# Altium project FSAE_BSPD_Simple.PrjPcb
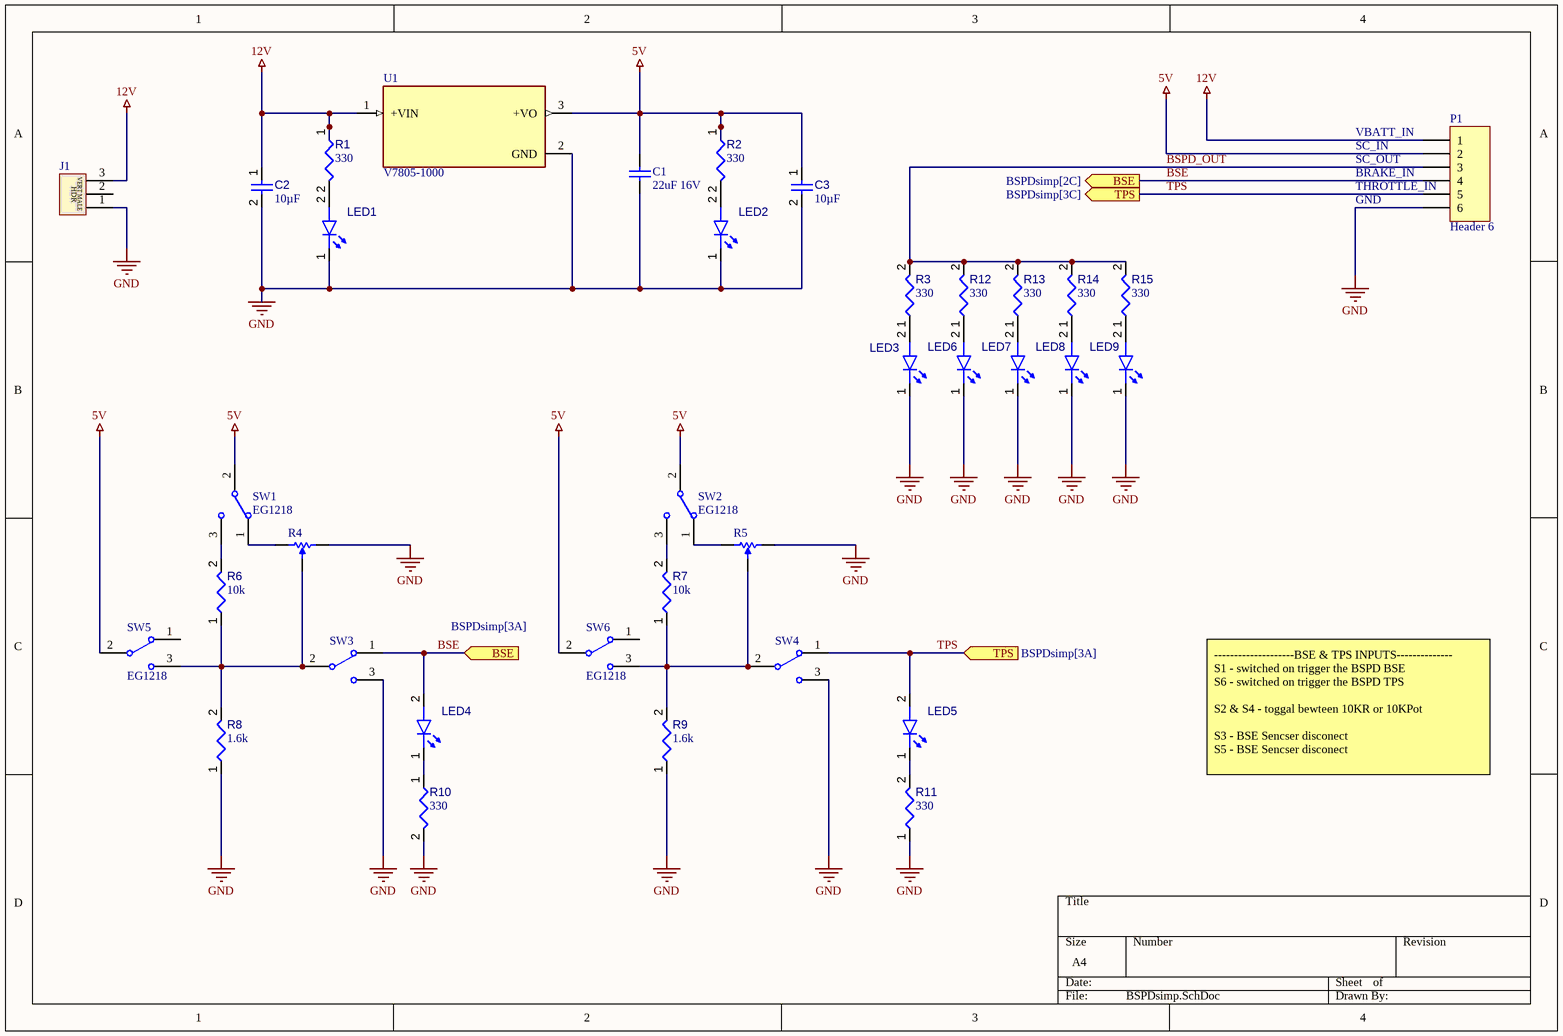
[diagram p0: BSPDsimp.SchDoc]
1 sheet, 36 parts. Net scope: flat (ports and power ports of the same name join across sheets).
Board file: FSAE_BSPD_Simple.PcbDoc

## Sheet BSPDsimp.SchDoc
size A4; SheetNumber: 1; SheetTotal: 1

### Parts
C1  22uF 16V  [CAPC2012X14N]
C2  value 10µF  [CAPC2013X135X45NL10T25]  (hidden comment: Capacitor 10 uF +/- 10% 16 V 0805)
C3  value 10µF  [CAPC2013X135X45NL10T25]  (hidden comment: Capacitor 10 uF +/- 10% 16 V 0805)
J1  HDR-3X1-VERT-2.54MM-1SIDE_SHROUD_1  [HDR-1X3-2.54MM-1SIDE_SHROUD]  (value not drawn)
LED1  QBLP595-IG  [QTB-QBLP595_V]  (value not drawn)
LED2  QBLP595-IG  [QTB-QBLP595_V]  (value not drawn)
LED3  QBLP595-IG  [QTB-QBLP595_V]  (value not drawn)
LED4  QBLP595-IG  [QTB-QBLP595_V]  (value not drawn)
LED5  QBLP595-IG  [QTB-QBLP595_V]  (value not drawn)
LED6  QBLP595-IG  [QTB-QBLP595_V]  (value not drawn)
LED7  QBLP595-IG  [QTB-QBLP595_V]  (value not drawn)
LED8  QBLP595-IG  [QTB-QBLP595_V]  (value not drawn)
LED9  QBLP595-IG  [QTB-QBLP595_V]  (value not drawn)
P1  Header 6  [HDR1X6]
R1  value 330  [RESC0402(1005)_L]  (hidden comment: 330R2J)
R2  value 330  [RESC0402(1005)_L]  (hidden comment: 330R2J)
R3  value 330  [RESC0402(1005)_L]  (hidden comment: 330R2J)
R4  35WR10KLFTR  [BI-35WR10KLFTR-3_V]  (value not drawn)
R5  35WR10KLFTR  [BI-35WR10KLFTR-3_V]  (value not drawn)
R6  value 10k  [RESC0402(1005)_L]  (hidden comment: 10KR2F)
R7  value 10k  [RESC0402(1005)_L]  (hidden comment: 10KR2F)
R8  value 1.6k  [RESC0402(1005)_L]  (hidden comment: 1D6KR2J)
R9  value 1.6k  [RESC0402(1005)_L]  (hidden comment: 1D6KR2J)
R10  value 330  [RESC0402(1005)_L]  (hidden comment: 330R2J)
R11  value 330  [RESC0402(1005)_L]  (hidden comment: 330R2J)
R12  value 330  [RESC0402(1005)_L]  (hidden comment: 330R2J)
R13  value 330  [RESC0402(1005)_L]  (hidden comment: 330R2J)
R14  value 330  [RESC0402(1005)_L]  (hidden comment: 330R2J)
R15  value 330  [RESC0402(1005)_L]  (hidden comment: 330R2J)
SW1  EG1218  [ESWI-EG1218_V]
SW2  EG1218  [ESWI-EG1218_V]
SW3  EG1218  [ESWI-EG1218_V]  (value not drawn)
SW4  EG1218  [ESWI-EG1218_V]  (value not drawn)
SW5  EG1218  [ESWI-EG1218_V]
SW6  EG1218  [ESWI-EG1218_V]
U1  V7805-1000  [CONV_V7805-1000]

### Ports
BSE (in, see BSPDsimp[3A]), BSE (out, see BSPDsimp[2C]), TPS (in, see BSPDsimp[3A]), TPS (out, see BSPDsimp[3C])

### Nets
5V: C1.2 C3.1 P1.2 R2.1 SW1.2(COM) SW2.2(COM) SW5.2(COM) SW6.2(COM) U1.3(+VO)
12V: C2.1 J1.3 P1.1 R1.1 U1.1(+VIN)
GND: C1.1 C2.2 C3.2 J1.1 LED1.1(K) LED2.1(K) LED3.1(K) LED6.1(K) LED7.1(K) LED8.1(K) LED9.1(K) P1.6 R4.3 R5.3 R8.1 R9.1 R10.2 R11.1 SW3.3 SW4.3 U1.2(GND)
BSE: LED4.2(A) P1.4 SW3.1 ; port BSE
BSPD_OUT: P1.3 R3.2 R12.2 R13.2 R14.2 R15.2
TPS: LED5.2(A) P1.5 SW4.1 ; port TPS
NetLED1_2: LED1.2(A) R1.2
NetLED2_2: LED2.2(A) R2.2
NetLED3_2: LED3.2(A) R15.1
NetLED4_1: LED4.1(K) R10.1
NetLED5_1: LED5.1(K) R11.2
NetLED6_2: LED6.2(A) R3.1
NetLED7_2: LED7.2(A) R12.1
NetLED8_2: LED8.2(A) R13.1
NetLED9_2: LED9.2(A) R14.1
NetR4_1: R4.1 SW1.1
NetR4_2: R4.2 R6.1 R8.2 SW3.2(COM) SW5.3
NetR5_1: R5.1 SW2.1
NetR5_2: R5.2 R7.1 R9.2 SW4.2(COM) SW6.3
NetR6_2: R6.2 SW1.3
NetR7_2: R7.2 SW2.3

Not connected (* = marked no-connect by the designer): J1 2; SW5 1; SW6 1

### Notes on the sheet
- (near P1) VBATT_IN
- SC_IN
- SC_OUT
- (near P1) BRAKE_IN
- (near P1) THROTTLE_IN
- GND
- --------------------BSE & TPS INPUTS--------------
  S1 - switched on trigger the BSPD BSE
  S6 - switched on trigger the BSPD TPS
  S2 & S4 - toggal bewteen 10KR or 10KPot
  S3 - BSE Sencser disconect
  S5 - BSE Sencser disconect
- (in symbol CMP-012-000045-1) VERT MALE; HDR

### Library data of the parts
C1 = C-0805-CER-22UF-X5R-16V: CAP CER 22UF 16V X5R 0805; Voltage Max: 35V; Supplier 1: Digi-Key; Supplier Part Number 1: 1276-6780-1-ND; Mounting Technology: Surface Mount; Temperature Max: 85; Temperature Min: -55
C2 C3 = CMP-001-00015-6: Chip Capacitor, 10 uF, +/- 10%, 16 V, 0805 (2012 Metric); Voltage Rating: 16V; Capacitor Type: Ceramic; RoHS Compliant: True; Max Operating Temperature: 85°C; Min Operating Temperature: -55°C; Mounting Technology: SM; Tolerance: 10%; Case/Package: 0805; Pins: 2
J1 = CMP-012-000045-1: CONN HEADER VERT 3POS 2.54MM; Mounting Technology: Surface Mount; Source: Other.SchLib; Design Item ID: HDR-3X1-VERT-2.54MM-1SIDE_SHROUD_1
LED1-LED9 = CMP-007-00041-3: Chip LED 0402, Green, 0.02 A, 3.1 to 3.7 V, -40 to 80 degC, 2-Pin SMD, RoHS, Tape and Reel; Case/Package: 0402; Colour: Green; Mounting Technology: SMT; Pins: 2; RoHS Compliant: Yes
P1 = Header 6: Header, 6-Pin; LatestRevisionDate: 17-Jul-2002; LatestRevisionNote: Re-released for DXP Platform.; Publisher: Altium Limited
R1-R3 R10-R15 = CMP-009-00095-2: 330R 0.063W 5% 0402 (1005 Metric)  SMD; Power: 63mW; Tolerance: 5%; Mounting Technology: SMT; Case/Package: 0402; Pins: 2
R4 R5 = CMP-009-00041-2: 3 mm Single-Turn Open Frame Surface Mount Cermet Trimming Potentiometer, +/- 25%, 35 W, -40 to 125 degC, 3-Pin SMD, RoHS, Tape and Reel; Manufacturer: BI Technologies; Resistance: 10k; Power: 100mW; Voltage Rating: 50V; Mounting Technology: SM; RoHS Compliant: True; Manufacturer URL: http://www.bi-technologies.net/; Package Quantity: 2000; Package Description: 3-Pin Surface Mount Device, Body 3 x 3.1 mm; Max Operating Temperature: 125°C; Composition: Potentiometer; Packaging: TapeandReel; Datasheet Version: Feb-10; Datasheet URL: http://www.bitechnologies.com/pdfs/35.pdf; Min Operating Temperature: -40°C; Package Reference: 35WR10KLFTR; Case/Package: 35WR10KLFTR; Tolerance: 25%
R6 R7 = CMP-009-00066-2: 10K 0.063W 1% 0402 (1005 Metric)  SMD; Power: 63mW; Case/Package: 0402; Mounting Technology: SMT; Pins: 2; Tolerance: 1%
R8 R9 = CMP-009-00073-2: 1K6 0.063W 5% 0402 (1005 Metric)  SMD; Power: 63mW; Case/Package: 0402; Tolerance: 5%; Mounting Technology: SMT; Pins: 2
SW1-SW6 = CMP-011-00006-2: Slide Switch, SPDT, 500 V, -20 to 70 degC, 3-Pin THD, RoHS, Bulk; Manufacturer: E-Switch; Voltage Rating (DC): 30V; Current Rating: 200mA; Operating Force: 250gf; Package Quantity: 1000; Contact Plating: Silver; Max Operating Temperature: 70°C; Min Operating Temperature: -20°C; Contact Material: Copper; Datasheet URL: https://www.e-switch.com/system/asset/product_line/data_sheet/119/EG.pdf; Contact Finish: Silver; Case/Package: EG1218; Voltage Rating (AC): 30V; Datasheet Version: Oct-15; Package Description: 3-Pin Through Hole Device, Body 11.6 x 4 mm, Pitch 2.5 mm; RoHS Compliant: True; Package Reference: EG1218; Manufacturer URL: http://www.e-switch.ch/en/; Throw Configuration: SPDT; Contact Current Rating: 200mA; Mounting Technology: TH; Packaging: Bulk; Pins: 3
U1 = V7805-1000: 3.3 Vdc, 1 A, 1.65 W, 4.5~28 Vdc Input Range; MF: {'manufacturer': u'CUI'}; Price: None; MP: V7805-1000; Availability: Unavailable; Value: *; Package: None